# Altium schematic sheet FPGA_MONITOR.SchDoc
size 393 x 281 mm; PageSetup: Record=PageOptions|CenterHorizontal=True|CenterVertical=True|PrintScale=0.94|XCorrection=0.00|YCorrection=0.00|PrintKind=0|BorderSize=5000000|LeftOffset=0|BottomOffset=0|Orientation=2|PaperLength=1000|PaperWidth=1000|Scale=100|PaperSource=15|PrintQuality=600|MediaType=1|DitherType=10|PrintScaleMode=1|PaperKind=A4; Adr1: August Barks gata 6B; Adr2: SE-421 32 Västra Frölunda; Adr3: Sweden; Webpage: www.omnisys.se
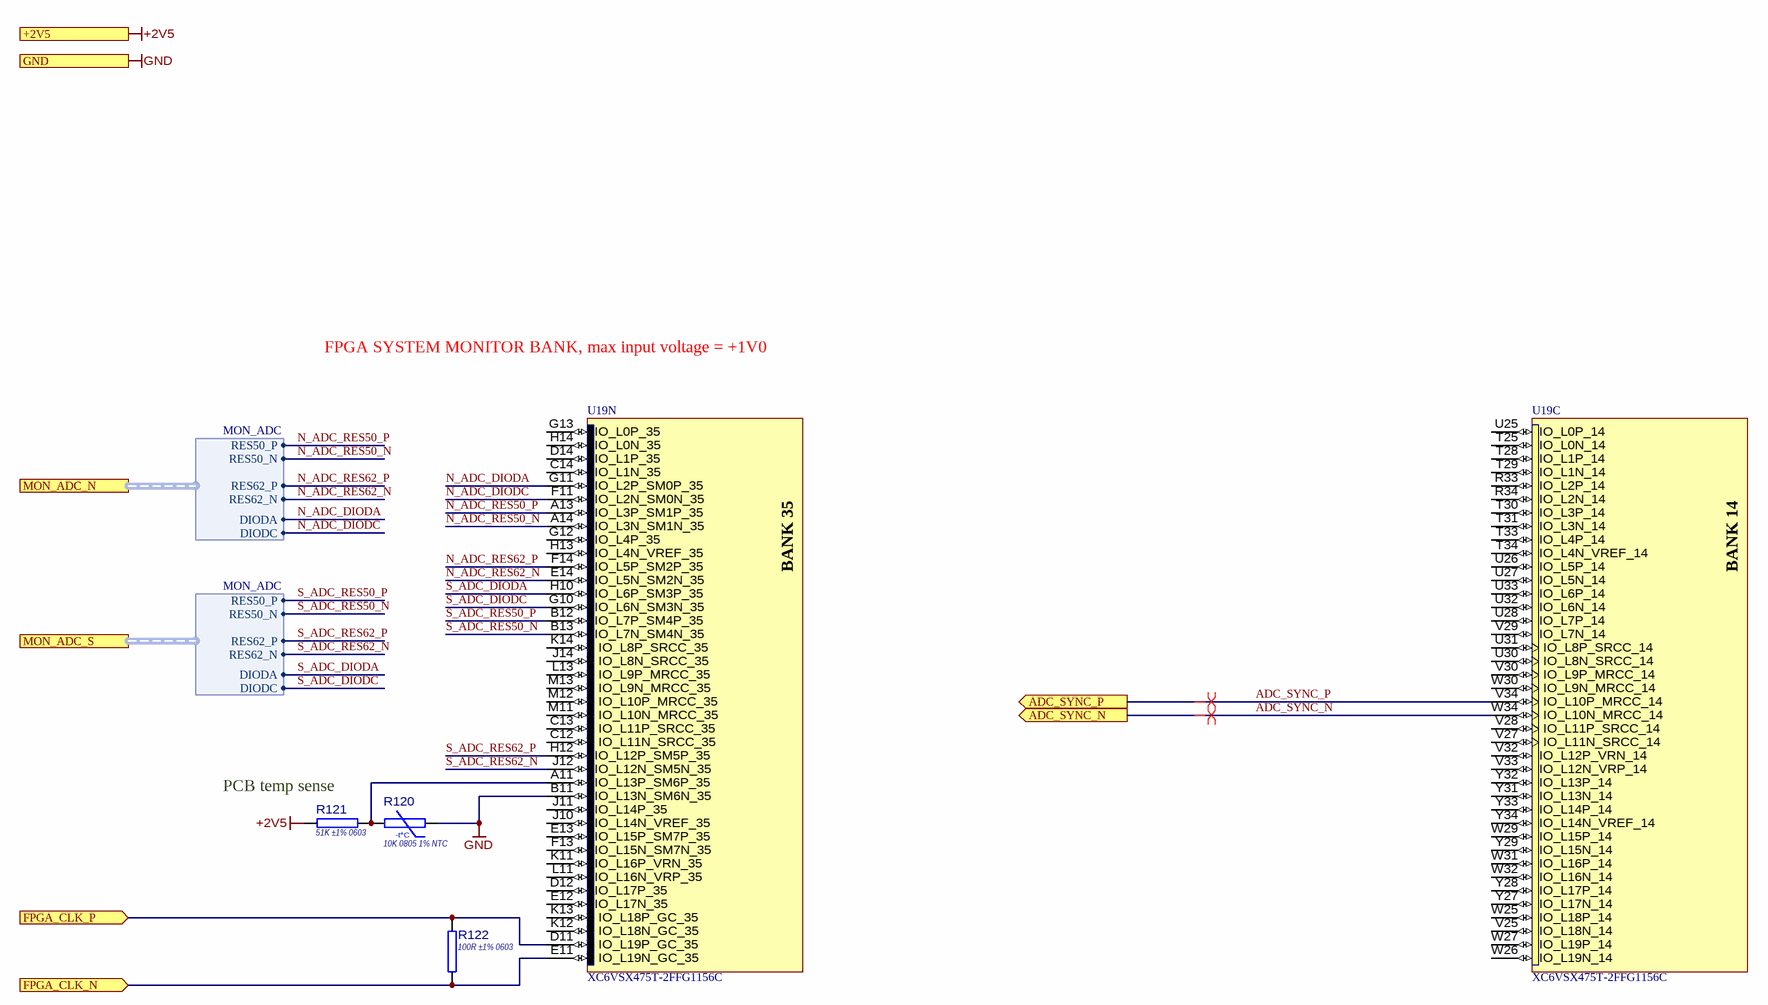
[diagram p0: FPGA_MONITOR.SchDoc]

## Parts
R120  10K 0805 1% NTC  [RESC2012N]
R121  51K ±1% 0603  [RESC1608N]
R122  100R ±1% 0603  [RESC1608N]
U19  XC6VSX475T-2FFG1156C  [FFG1156]  (parts C,N of 20)

## Ports
+2V5, ADC_SYNC_N (out), ADC_SYNC_P (out), FPGA_CLK_N (in), FPGA_CLK_P (in), GND, MON_ADC_N (harness MON_ADC), MON_ADC_S (harness MON_ADC)

## Harnesses
MON_ADC: DIODA, DIODC, RES50_P, RES50_N, RES62_P, RES62_N

## Nets
+2V5: R121.1 ; port +2V5
GND: R120.1 U19.B11(IO_L13N_SM6N_35) ; port GND
ADC_SYNC_N: U19.W34(IO_L10N_MRCC_14) ; port ADC_SYNC_N
ADC_SYNC_P: U19.V34(IO_L10P_MRCC_14) ; port ADC_SYNC_P
FPGA_CLK_N: R122.1 U19.E11(IO_L19N_GC_35) ; port FPGA_CLK_N
FPGA_CLK_P: R122.2 U19.D11(IO_L19P_GC_35) ; port FPGA_CLK_P
N_ADC_DIODA: U19.G11(IO_L2P_SM0P_35) ; port MON_ADC_N.DIODA
N_ADC_DIODC: U19.F11(IO_L2N_SM0N_35) ; port MON_ADC_N.DIODC
N_ADC_RES50_N: U19.A14(IO_L3N_SM1N_35) ; port MON_ADC_N.RES50_N
N_ADC_RES50_P: U19.A13(IO_L3P_SM1P_35) ; port MON_ADC_N.RES50_P
N_ADC_RES62_N: U19.E14(IO_L5N_SM2N_35) ; port MON_ADC_N.RES62_N
N_ADC_RES62_P: U19.F14(IO_L5P_SM2P_35) ; port MON_ADC_N.RES62_P
S_ADC_DIODA: U19.H10(IO_L6P_SM3P_35) ; port MON_ADC_S.DIODA
S_ADC_DIODC: U19.G10(IO_L6N_SM3N_35) ; port MON_ADC_S.DIODC
S_ADC_RES50_N: U19.B13(IO_L7N_SM4N_35) ; port MON_ADC_S.RES50_N
S_ADC_RES50_P: U19.B12(IO_L7P_SM4P_35) ; port MON_ADC_S.RES50_P
S_ADC_RES62_N: U19.J12(IO_L12N_SM5N_35) ; port MON_ADC_S.RES62_N
S_ADC_RES62_P: U19.H12(IO_L12P_SM5P_35) ; port MON_ADC_S.RES62_P
NetR120_2: R120.2 R121.2 U19.A11(IO_L13P_SM6P_35)

Not connected (* = marked no-connect by the designer): U19 C12(IO_L11N_SRCC_35) C13(IO_L11P_SRCC_35) C14(IO_L1N_35) D12(IO_L17P_35) D14(IO_L1P_35) E12(IO_L17N_35) E13(IO_L15P_SM7P_35) F13(IO_L15N_SM7N_35) G12(IO_L4P_35) G13(IO_L0P_35) H13(IO_L4N_VREF_35) H14(IO_L0N_35) J10(IO_L14N_VREF_35) J11(IO_L14P_35) J14(IO_L8N_SRCC_35) K11(IO_L16P_VRN_35) K12(IO_L18N_GC_35) K13(IO_L18P_GC_35) K14(IO_L8P_SRCC_35) L11(IO_L16N_VRP_35) L13(IO_L9P_MRCC_35) M11(IO_L10N_MRCC_35) M12(IO_L10P_MRCC_35) M13(IO_L9N_MRCC_35) R33(IO_L2P_14) R34(IO_L2N_14) T25(IO_L0N_14) T28(IO_L1P_14) T29(IO_L1N_14) T30(IO_L3P_14) T31(IO_L3N_14) T33(IO_L4P_14) T34(IO_L4N_VREF_14) U25(IO_L0P_14) U26(IO_L5P_14) U27(IO_L5N_14) U28(IO_L7P_14) U30(IO_L8N_SRCC_14) U31(IO_L8P_SRCC_14) U32(IO_L6N_14) U33(IO_L6P_14) V25(IO_L18N_14) V27(IO_L11N_SRCC_14) V28(IO_L11P_SRCC_14) V29(IO_L7N_14) V30(IO_L9P_MRCC_14) V32(IO_L12P_VRN_14) V33(IO_L12N_VRP_14) W25(IO_L18P_14) W26(IO_L19N_14) W27(IO_L19P_14) W29(IO_L15P_14) W30(IO_L9N_MRCC_14) W31(IO_L16P_14) W32(IO_L16N_14) Y27(IO_L17N_14) Y28(IO_L17P_14) Y29(IO_L15N_14) Y31(IO_L13N_14) Y32(IO_L13P_14) Y33(IO_L14P_14) Y34(IO_L14N_VREF_14)

## Layout directives
differential pair: ADC_SYNC_N, ADC_SYNC_P

## Notes on the sheet
- FPGA SYSTEM MONITOR BANK, max input voltage = +1V0
- (near R121) PCB temp sense
- Title:
- SVN:
- August Barks gata 6B
- SE-421 32 Västra Frölunda
- Omnisys Instruments AB
- PCB ASY:
- PCB:
- SVN Folder:
- www.omnisys.se
- Page:
- of
- Print date:
- Page size:
- A3
- Information contained in this drawing is confidential. Copying, distributing or use in any matter, other than that specified by OMNISYS INSTRUMENTS AB, is strictly prohibited.
- (in symbol CMP-0083-00172-1, part C) BANK 14
- (in symbol CMP-0083-00172-1, part N) BANK 35
- (in symbol CMP-1800-003166-1) -t°C

## Library data of the parts
R120 = CMP-1800-003166-1: 10K NTC resistor 1%  0805 (2012 metric); PartNumber: NTCS0805E3103FLT; Case-EIA: 0805; Case-Metric: 2012
R121 = CMP-1800-002062-3: 51K ±1% ±100 ppm/˚C 0.10W 75V 0603 (1608 metric); Power: 100mW; Case-EIA: 0603; Case-Metric: 1608; Temp. Coefficent: 0.01%; Value: 51k; Maximum working voltage: 75V; Tolerance: 1%; Technology: SMT
R122 = CMP-1800-001998-3: 100R ±1% ±100 ppm/˚C 0.10W 75V 0603 (1608 metric); Value: 100; Power: 100mW; Case-EIA: 0603; Case-Metric: 1608; Temp. Coefficent: 0.01%; Maximum working voltage: 75V; Tolerance: 1%; Technology: SMT
U19 = CMP-0083-00172-1: Virtex-6 SXT Platform FPGA, 600 User I/Os, 20 GTXs, 1156-Ball FFBGA, Speed Grade 2, Commercial Grade, Pb-Free; Code_JEDEC: MS-034-AAR-1; PackageReference: FFG1156; Code_IPC: BGA100P34X34-1156; PackageDescription: 1156-Ball Flip-Chip Fine Pitch Ball Grid Array (FFG1156) - Pb-Free; PackageVersion: ver1.0, Jan-2010; DatasheetVersion: ver2.2, Jan-2010; PartId: 1